# Altium schematic sheet Scheme.SchDoc
size 420 x 297 mm; Author: ALTIUM GOSTBOM2.0 KEV; SheetNumber: 4; SheetTotal: 4
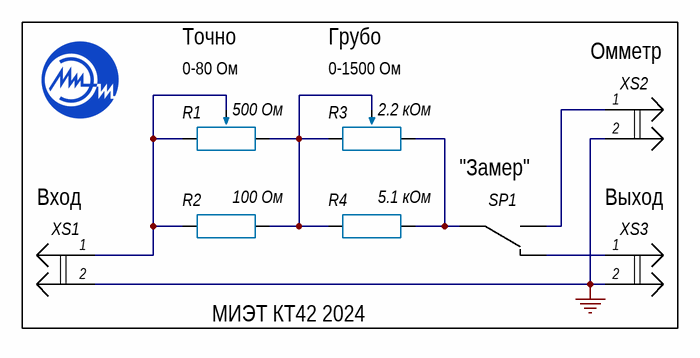
[diagram p0: Scheme.SchDoc]

## Parts
(Parts that share a designator on the sheet are numbered #1, #2 ... from top to bottom, then left to right.)
*#1  XP2  (value not drawn)
*#2  XP2  (value not drawn)
*#3  XP2  (value not drawn)
R?#1  R4_PEREMENNYJ  (value not drawn)
R?#2  R4_PEREMENNYJ  (value not drawn)
R?#3  R1_POSTOYANNYJ  (value not drawn)
R?#4  R1_POSTOYANNYJ  (value not drawn)
SA?  SS-12F44  [SS-12F]  (value not drawn)

## Nets
GND: *#1.2 *#2.2 *#3.2
Net*#1_1: *#1.1 SA?.1
Net*#2_1: *#2.1 R?#1.1 R?#1.3 R?#3.2
Net*#3_1: *#3.1 SA?.3
NetR?#1_2: R?#1.2 R?#2.1 R?#2.3 R?#3.1 R?#4.2
NetR?#2_2: R?#2.2 R?#4.1 SA?.2

## Notes on the sheet
- Точно
- (near R?#1) 0-80 Ом
- Грубо
- (near R?#2) 0-1500 Ом
- (near *#1) Омметр
- (near R?#1) R1
- (near R?#1) 500 Ом
- (near R?#2) R3
- (near R?#2) 2.2 кОм
- (near *#1) XS2
- (near *#2) Вход
- (near R?#3) R2
- (near R?#3) 100 Ом
- (near R?#4) R4
- (near R?#4) 5.1 кОм
- "Замер"
- (near SA?) SP1
- (near *#3) Выход
- (near *#2) XS1
- (near *#3) XS3
- МИЭТ КТ42 2024
- Перв. примен.
- Справ. №
- Подп. дата
- Инв. № дубл.
- Взам. инв. №
- Подп. и дата
- Изм.
- Разраб.
- Лист
- № докум.
- Подп.
- Дата
- Лит.
- Масса
- Масштаб
- Пров.
- Т.контр.
- Листов
- Инв. № подл.
- Н.контр.
- Утв.
- ALTIUM GOSTBOM2.0 KEV
- Файл:
- Копировал
- Формат А3

## Library data of the parts
R?#1 R?#2 = R4_PEREMENNYJ: Резистор переменный
R?#3 R?#4 = R1_POSTOYANNYJ: Резистор постоянный
SA? = SS-12F44: Switcher SS-12F44; Part Number: SS-12F44; ComponentLink1Description: Datasheet